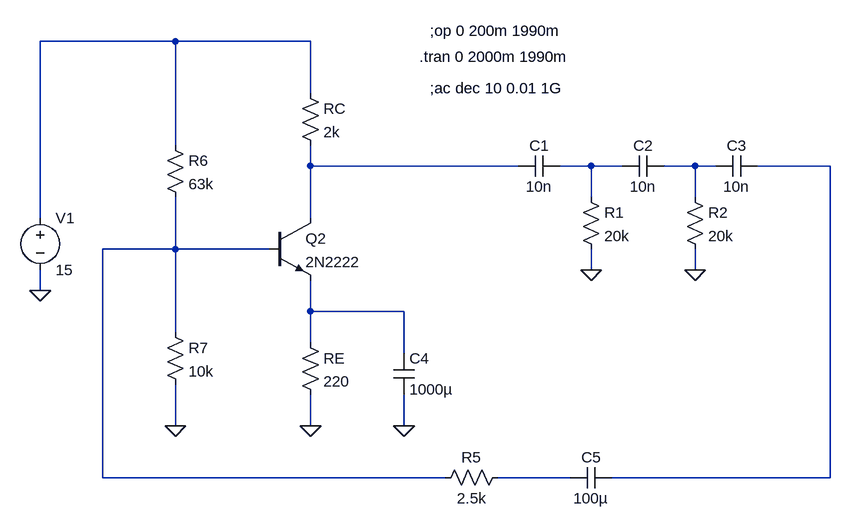
[diagram p0: schematic RC-Phase Oscillator.asc]
RC-Phase Oscillator.asc, the LTspice schematic file:
Version 4
SHEET 1 964 680
WIRE -48 -144 -256 -144
WIRE 160 -144 -48 -144
WIRE 160 -64 160 -144
WIRE -48 16 -48 -144
WIRE 160 48 160 16
WIRE 480 48 160 48
WIRE 592 48 544 48
WIRE 640 48 592 48
WIRE 752 48 704 48
WIRE 784 48 752 48
WIRE 960 48 848 48
WIRE 592 96 592 48
WIRE 752 96 752 48
WIRE -256 128 -256 -144
WIRE 160 128 160 48
WIRE -48 176 -48 96
WIRE -48 176 -160 176
WIRE 96 176 -48 176
WIRE 592 208 592 176
WIRE 752 208 752 176
WIRE -256 240 -256 208
WIRE 160 272 160 224
WIRE 304 272 160 272
WIRE -48 304 -48 176
WIRE 160 320 160 272
WIRE 304 336 304 272
WIRE -48 448 -48 384
WIRE 160 448 160 400
WIRE 304 448 304 400
WIRE -160 528 -160 176
WIRE 368 528 -160 528
WIRE 560 528 448 528
WIRE 960 528 960 48
WIRE 960 528 624 528
FLAG -256 240 0
FLAG 304 448 0
FLAG 160 448 0
FLAG -48 448 0
FLAG 752 208 0
FLAG 592 208 0
SYMBOL voltage -256 112 R0
WINDOW 123 0 0 Left 0
WINDOW 39 0 0 Left 0
SYMATTR InstName V1
SYMATTR Value 15
SYMBOL res -64 0 R0
SYMATTR InstName R6
SYMATTR Value 63k
SYMBOL res -64 288 R0
SYMATTR InstName R7
SYMATTR Value 10k
SYMBOL res 144 -80 R0
SYMATTR InstName RC
SYMATTR Value 2k
SYMBOL res 144 304 R0
SYMATTR InstName RE
SYMATTR Value 220
SYMBOL cap 288 336 R0
SYMATTR InstName C4
SYMATTR Value 1000µ
SYMBOL cap 544 32 R90
WINDOW 0 0 32 VBottom 2
WINDOW 3 32 32 VTop 2
SYMATTR InstName C1
SYMATTR Value 10n
SYMBOL res 464 512 R90
WINDOW 0 0 56 VBottom 2
WINDOW 3 32 56 VTop 2
SYMATTR InstName R5
SYMATTR Value 2.5k
SYMBOL npn 96 128 R0
SYMATTR InstName Q2
SYMATTR Value 2N2222
SYMBOL cap 704 32 R90
WINDOW 0 0 32 VBottom 2
WINDOW 3 32 32 VTop 2
SYMATTR InstName C2
SYMATTR Value 10n
SYMBOL cap 848 32 R90
WINDOW 0 0 32 VBottom 2
WINDOW 3 32 32 VTop 2
SYMATTR InstName C3
SYMATTR Value 10n
SYMBOL cap 624 512 R90
WINDOW 0 0 32 VBottom 2
WINDOW 3 32 32 VTop 2
SYMATTR InstName C5
SYMATTR Value 100µ
SYMBOL res 576 80 R0
SYMATTR InstName R1
SYMATTR Value 20k
SYMBOL res 736 80 R0
SYMATTR InstName R2
SYMATTR Value 20k
TEXT 344 -160 Left 2 !;op 0 200m 1990m
TEXT 328 -120 Left 2 !.tran 0 2000m 1990m
TEXT 344 -72 Left 2 !;ac dec 10 0.01 1G

The netlist it stands for:
* RC-Phase Oscillator.asc
V1 N001 0 15
R6 N001 N006 63k
R7 N006 0 10k
RC N001 N002 2k
RE N007 0 220
C4 N007 0 1000µ
C1 N003 N002 10n
R5 N008 N006 2.5k
Q2 N002 N006 N007 0 2N2222
C2 N004 N003 10n
C3 N005 N004 10n
C5 N005 N008 100µ
R1 N003 0 20k
R2 N004 0 20k
.model NPN NPN
.model PNP PNP
.lib standard.bjt
;op 0 200m 1990m
.tran 0 2000m 1990m
;ac dec 10 0.01 1G
.backanno
.end